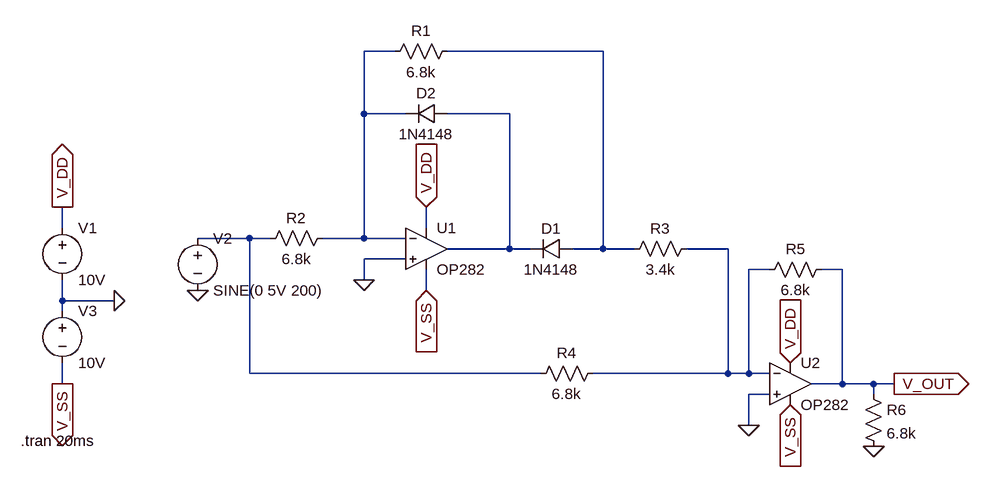
[diagram p0: schematic Full Precision Rectifier.asc]
Full Precision Rectifier.asc, the LTspice schematic file:
Version 4
SHEET 1 1116 680
WIRE 208 -128 160 -128
WIRE 528 -128 288 -128
WIRE 160 -32 160 -128
WIRE 224 -32 160 -32
WIRE 384 -32 288 -32
WIRE -304 144 -304 112
WIRE 256 144 256 112
WIRE -16 160 -96 160
WIRE 16 160 -16 160
WIRE 160 160 160 -32
WIRE 160 160 96 160
WIRE 224 160 160 160
WIRE 384 176 384 -32
WIRE 384 176 288 176
WIRE 416 176 384 176
WIRE 528 176 528 -128
WIRE 528 176 480 176
WIRE 576 176 528 176
WIRE 720 176 656 176
WIRE 224 192 160 192
WIRE 784 208 752 208
WIRE 896 208 864 208
WIRE 160 224 160 192
WIRE 256 240 256 208
WIRE -304 256 -304 224
WIRE -224 256 -304 256
WIRE -304 272 -304 256
WIRE -16 368 -16 160
WIRE 432 368 -16 368
WIRE 720 368 720 176
WIRE 720 368 512 368
WIRE 752 368 752 208
WIRE 752 368 720 368
WIRE 784 368 752 368
WIRE -304 384 -304 352
WIRE 896 384 896 208
WIRE 896 384 848 384
WIRE 944 384 896 384
WIRE 976 384 944 384
WIRE 784 400 752 400
WIRE 944 400 944 384
WIRE 752 448 752 400
FLAG -224 256 0
FLAG -304 112 V_DD
IOPIN -304 112 Out
FLAG 256 112 V_DD
IOPIN 256 112 In
FLAG -96 240 0
FLAG 752 448 0
FLAG 816 352 V_DD
IOPIN 816 352 In
FLAG 944 480 0
FLAG 976 384 V_OUT
IOPIN 976 384 Out
FLAG 160 224 0
FLAG -304 384 V_SS
IOPIN -304 384 Out
FLAG 256 240 V_SS
IOPIN 256 240 In
FLAG 816 416 V_SS
IOPIN 816 416 In
SYMBOL OpAmps\\OP282 256 112 R0
SYMATTR InstName U1
SYMBOL voltage -304 128 R0
WINDOW 123 0 0 Left 0
WINDOW 39 0 0 Left 0
SYMATTR InstName V1
SYMATTR Value 10V
SYMBOL diode 480 160 R90
WINDOW 0 0 32 VBottom 2
WINDOW 3 32 32 VTop 2
SYMATTR InstName D1
SYMATTR Value 1N4148
SYMBOL diode 288 -48 R90
WINDOW 0 0 32 VBottom 2
WINDOW 3 32 32 VTop 2
SYMATTR InstName D2
SYMATTR Value 1N4148
SYMBOL res 304 -144 R90
WINDOW 0 0 56 VBottom 2
WINDOW 3 32 56 VTop 2
SYMATTR InstName R1
SYMATTR Value 6.8k
SYMBOL res 112 144 R90
WINDOW 0 0 56 VBottom 2
WINDOW 3 32 56 VTop 2
SYMATTR InstName R2
SYMATTR Value 6.8k
SYMBOL res 672 160 R90
WINDOW 0 0 56 VBottom 2
WINDOW 3 32 56 VTop 2
SYMATTR InstName R3
SYMATTR Value 3.4k
SYMBOL res 528 352 R90
WINDOW 0 0 56 VBottom 2
WINDOW 3 32 56 VTop 2
SYMATTR InstName R4
SYMATTR Value 6.8k
SYMBOL voltage -96 144 R0
WINDOW 123 0 0 Left 0
WINDOW 39 0 0 Left 0
SYMATTR InstName V2
SYMATTR Value SINE(0 5V 200)
SYMBOL OpAmps\\OP282 816 320 R0
SYMATTR InstName U2
SYMBOL res 880 192 R90
WINDOW 0 0 56 VBottom 2
WINDOW 3 32 56 VTop 2
SYMATTR InstName R5
SYMATTR Value 6.8k
SYMBOL res 928 384 R0
SYMATTR InstName R6
SYMATTR Value 6.8k
SYMBOL voltage -304 256 R0
WINDOW 123 0 0 Left 0
WINDOW 39 0 0 Left 0
SYMATTR InstName V3
SYMATTR Value 10V
TEXT -368 472 Left 2 !.tran 20ms

The netlist it stands for:
* Full Precision Rectifier.asc
XU1 0 N001 V_DD V_SS N003 OP282  ; pins In+ In- V+ V- OUT
V1 V_DD 0 10V
D1 N002 N003 1N4148
D2 N003 N001 1N4148
R1 N002 N001 6.8k
R2 N001 N004 6.8k
R3 N005 N002 3.4k
R4 N005 N004 6.8k
V2 N004 0 SINE(0 5V 200)
XU2 0 N005 V_DD V_SS V_OUT OP282  ; pins In+ In- V+ V- OUT
R5 V_OUT N005 6.8k
R6 V_OUT 0 6.8k
V3 0 V_SS 10V
.model D D
.lib standard.dio
.tran 20ms
.backanno
.end